# Altium schematic sheet Analog_PSU_5.SchDoc: Analog PSU
size A4; DrawnBy: Michael Watzek; Organization: HTL Hollabrunn; Address1: Abteilung Elektronik; Address2: Anton Ehrenfried-Straße 10; Address3: 2020 Hollabrunn; DocumentNumber: 11; Revision: 02; SheetNumber: 11; SheetTotal: 12; SPICEModelCacheRYPOANGS: <root> / <DocumentId>RYPOANGS</DocumentId> / <CacheFrame Number="0"> / <Model Name="cap" Kind="MDL"> / <Text>*Default semiconductor capacitor / .MODEL CAP C()</Text> / </Model> / </CacheFrame> / </root>
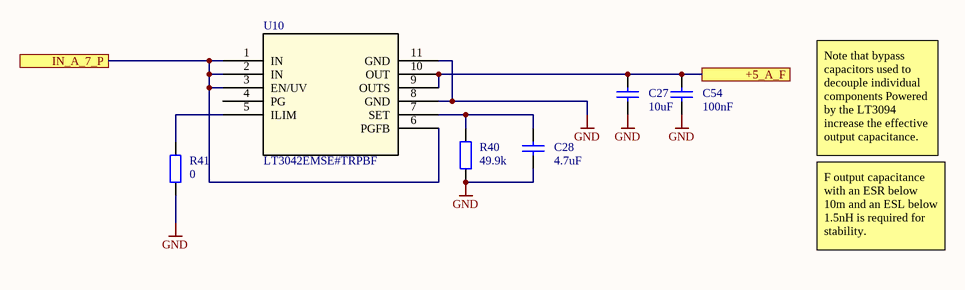
[diagram p0: Analog_PSU_5.SchDoc]

## Parts
C27  10uF  [C1206-KUE]
C28  4.7uF  [C1206-KUE]
C54  100nF  [C1206-KUE]
R40  49.9k  [C1206-KUE]
R41  0  [C1206-KUE]
U10  LT3042EMSE#TRPBF  [05-08-1664_ADI]

## Ports
+5_A_F, IN_A_7_P

## Nets
GND: C27.1 C28.1 C54.1 R40.2 R41.2 U10.8(GND) U10.11(GND)
+5_A_F: C27.2 C54.2 U10.9(OUTS) U10.10(OUT) ; port +5_A_F
IN_A_7_P: U10.1(IN) U10.2(IN) U10.3(EN/UV) U10.6(PGFB) ; port IN_A_7_P
NetC28_2: C28.2 R40.1 U10.7(SET)
NetR41_1: R41.1 U10.5(ILIM)

Not connected (* = marked no-connect by the designer): U10 4(PG)

## Notes on the sheet
- Note that bypass capacitors used to decouple individual components Powered by the LT3094 increase the effective output capacitance.
- F output capacitance with an ESR below 10m and an ESL below 1.5nH is required for stability.
- Title
- Size:
- Date:
- A4
- Number:
- Time:
- Revision:
- Sheet
- of
- HTL Hollabrunn
- Abteilung Elektronik
- Anton Ehrenfried-Straße 10
- 2020 Hollabrunn
- File:
- Drawn By:

## Library data of the parts
C27 C28 C54 = Capacitor: Manufacturer: Kemet; Bezeichnung: Kerko +-10% 63V; Published: 8-Jun-2000; LatestRevisionDate: 17-Jul-2002; LatestRevisionNote: Re-released for DXP Platform.; PackageReference: RAD-0.3; Publisher: Altium Limited; PackageDescription: Radial Cap, Thru-Hole; 2 Leads; 0.3 in Pin Spacing; Orderingcode: *
  C27: Value: 10uF
  C28: Value: 4.7uF
  C54: Value: 100nF
R40 R41 = ResistorSMD: Resistor SMD; Manufacturer: AVX; Bezeichnung: SMD Wid. 1/8W 2%; Published: 8-Jun-2000; LatestRevisionDate: 17-Jul-2002; LatestRevisionNote: Re-released for DXP Platform.; PackageReference: AXIAL-0.4; Publisher: Altium Limited; PackageDescription: Axial Device, Thru-Hole; 2 Leads; 0.4 in Pin Spacing; Orderingcode: *
  R40: Value: 49.9k
  R41: Value: 0
U10 = LT3042EMSETRPBF: 20V, 200mA, Ultralow Noise, Ultrahigh PSRR RF Linear Regulator; Manufacturer_Name: Analog Devices Inc; Type: Power Management; Copyright: Copyright (C) 2025 Ultra Librarian. All rights reserved.; Manufacturer_Part_Number: LT3042EMSE#TRPBF; RefDes: RefDes